# Altium project Ozgun_UKB_2025-2026.PrjPcb (part 2 of 4)
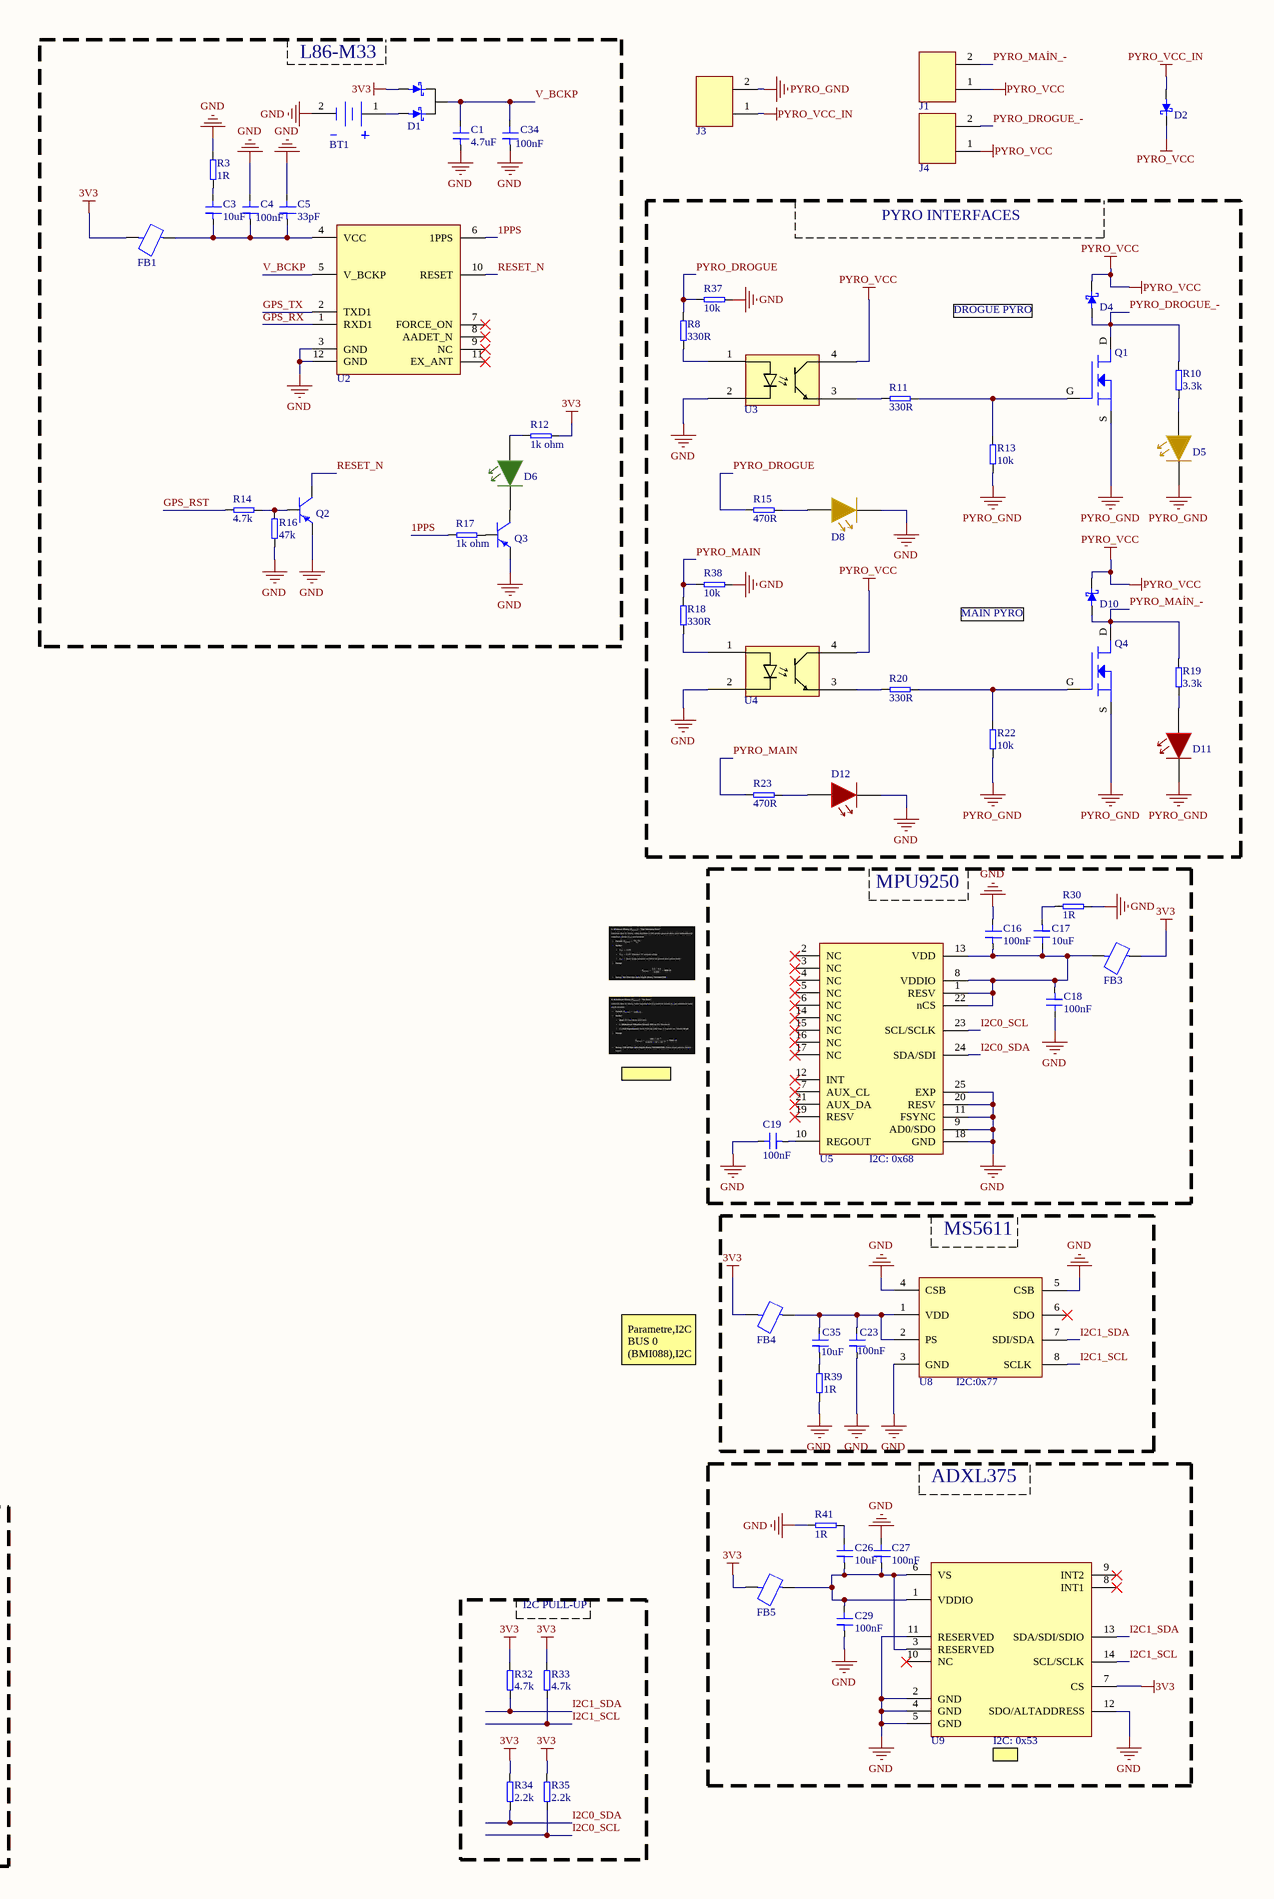
[diagram p2: Ucus_Kontrol_Bilgisayari.SchDoc, right]

## Sheet Ucus_Kontrol_Bilgisayari.SchDoc: AZAK ROKET TAKIMI ÖZGÜN UÇUŞ KONTROL BİLGİSAYARI (continued)
### Library data of the parts
BT1 = CR2032-1F2DV: Power-Xtra CR2032-1F2DV - 3V Li-MnO2 - Lithium Buton Pil - 2 Pinli - Dikey; ComponentLink1Description: Tedarikçi; ComponentLink1URL: https://www.pilpaketi.com/power-xtra-cr2032-1f2dv-3v-li-mno2-lithium-buton-pil-2-pinli-dikey; ComponentLink2Description: Tedarikçi; ComponentLink2URL: https://www.pilburada.com/power-xtra-cr2032-68-1f2-pin-dik-3v-lithium-pil-dikey; ComponentLink3Description: Tedarikçi**; ComponentLink3URL: https://www.robolinkmarket.com/power-xtra-cr2032-68-3v-lityum-dugme-pil-2-pin-dikey
C1 = Cap Cer 4.7uF %10 SMD 0603: Ceramic Capacitor, Multilayer, Ceramic, 16V, 10% +Tol, 10% -Tol, X5R, +-15% TC, 4.7uF, Surface Mount, 0603 inch; Manufacturer: Samsung Electro-Mechanics; Manufacturer Part Number: CL10A475KO8NNNC; Value: 4.7µF; Supplier: Mouser; Supplier Part Number: 187-CL10A475KO8NNNC; RoHS: Compliant; Category: Ceramic Capacitors; Stock: 255576; Pricing: 1=0,1, 10=0,014, 50=0,014, 100=0,014, 1000=0,014, 10000=0,014 (USD); Case/Package: 0603; Case Code (Imperial): 0603; Case Code (Metric): 1608; China RoHS: Compliant; Contact Plating: Tin; Depth: 800µm; Dielectric: X5R; Dielectric Material: Ceramic; Height: 900µm; Length: 1.6mm; Lifecycle Status: NRND; Material: Ceramic; Max Operating Temperature: 85°C; Min Operating Temperature: -55°C; Mounting Technology: Surface Mount; Number of Terminals: 2; Radiation Hardening: No; REACH SVHC: Yes; Schedule B: 8532240020, 8532240020|8532240020|8532240020|8532240020|8532240020|8532240020|8532240020|8532240020|8532240020|8532240020|8532240020|8532240020|8532240020|8532240020|8532240020|8532240020|8532240020|8532240020|8532240020|8532240020|8532240020|8532240020|8532240020|85; Thickness: 889µm; Tolerance: 10%; Voltage: 16V; Voltage Rating: 16V; Voltage Rating (DC): 16V; Width: 800µm; ComponentLink1URL: https://datasheet.octopart.com:443/CL10A475KO8NNNC-Samsung-Electro-Mechanics-datasheet-136031787.pdf?src-supplier=IHS; ComponentLink1Description: https://datasheet.octopart.com:443/CL10A475KO8NNNC-Samsung-Electro-Mechanics-datasheet-136031787.pdf?src-supplier=IHS; ComponentLink2URL: https://datasheet.octopart.com:443/CL10A475KO8NNNC-Samsung-Electro-Mechanics-datasheet-81461811.pdf?src-supplier=Upverter; ComponentLink2Description: https://datasheet.octopart.com:443/CL10A475KO8NNNC-Samsung-Electro-Mechanics-datasheet-81461811.pdf?src-supplier=Upverter; ComponentLink3URL: https://datasheet.octopart.com/CL10A475KO8NNNC-Samsung-Electro-Mechanics-datasheet-8324245.pdf; ComponentLink3Description: https://datasheet.octopart.com/CL10A475KO8NNNC-Samsung-Electro-Mechanics-datasheet-8324245.pdf; ComponentLink4URL: https://datasheet.octopart.com/CL10A475KO8NNNC-Samsung-Electro-Mechanics-datasheet-97040617.pdf; ComponentLink4Description: https://datasheet.octopart.com/CL10A475KO8NNNC-Samsung-Electro-Mechanics-datasheet-97040617.pdf; ComponentLink5URL: https://datasheet.octopart.com/General-Multilayer-Ceramic-Capacitors-Samsung-datasheet-family-111.pdf; ComponentLink5Description: https://datasheet.octopart.com/General-Multilayer-Ceramic-Capacitors-Samsung-datasheet-family-111.pdf; ComponentLink6URL: https://datasheet.octopart.com:443/CL10A475KO8NNNC-Samsung-Electro-Mechanics-datasheet-110226305.pdf?src-supplier=Future+Electronics; ComponentLink6Description: https://datasheet.octopart.com:443/CL10A475KO8NNNC-Samsung-Electro-Mechanics-datasheet-110226305.pdf?src-supplier=Future+Electronics; ComponentLink7URL: https://datasheet.octopart.com:443/CL10A475KO8NNNC-Samsung-datasheet-44382858.pdf?src-supplier=Future+Electronics; ComponentLink7Description: https://datasheet.octopart.com:443/CL10A475KO8NNNC-Samsung-datasheet-44382858.pdf?src-supplier=Future+Electronics; ComponentLink8URL: https://datasheet.octopart.com:443/CL10A475KO8NNNC-Samsung-datasheet-12513645.pdf?src-supplier=Future+Electronics; ComponentLink8Description: https://datasheet.octopart.com:443/CL10A475KO8NNNC-Samsung-datasheet-12513645.pdf?src-supplier=Future+Electronics; ComponentLink9URL: https://datasheet.octopart.com:443/CL10A475KO8NNNC-Samsung-datasheet-26589133.pdf?src-supplier=Future+Electronics; ComponentLink9Description: https://datasheet.octopart.com:443/CL10A475KO8NNNC-Samsung-datasheet-26589133.pdf?src-supplier=Future+Electronics; ComponentLink10URL: https://datasheet.octopart.com:443/CL10A475KO8NNNC-Samsung-datasheet-11541288.pdf?src-supplier=Future+Electronics; ComponentLink10Description: https://datasheet.octopart.com:443/CL10A475KO8NNNC-Samsung-datasheet-11541288.pdf?src-supplier=Future+Electronics; ComponentLink11URL: https://datasheet.octopart.com:443/CL10A475KO8NNNC-Samsung-Electro-Mechanics-datasheet-149158806.pdf?src-supplier=Future+Electronics; ComponentLink11Description: https://datasheet.octopart.com:443/CL10A475KO8NNNC-Samsung-Electro-Mechanics-datasheet-149158806.pdf?src-supplier=Future+Electronics; ComponentLink12URL: https://datasheet.octopart.com:443/CL10A475KO8NNNC-Samsung-Electro-Mechanics-datasheet-11892693.pdf?src-supplier=Arrow+Electronics; ComponentLink12Description: https://datasheet.octopart.com:443/CL10A475KO8NNNC-Samsung-Electro-Mechanics-datasheet-11892693.pdf?src-supplier=Arrow+Electronics; ComponentLink13URL: https://datasheet.octopart.com:443/CL10A475KO8NNNC-Samsung-datasheet-59220082.pdf?src-supplier=TME; ComponentLink13Description: https://datasheet.octopart.com:443/CL10A475KO8NNNC-Samsung-datasheet-59220082.pdf?src-supplier=TME; ComponentLink14URL: http://sigma.octopart.com:80/rohs_certificate/General-Multilayer-Ceramic-Capacitors-Samsung-family-110.pdf?src-supplier=Compliance+Statements; ComponentLink14Description: http://sigma.octopart.com:80/rohs_certificate/General-Multilayer-Ceramic-Capacitors-Samsung-family-110.pdf?src-supplier=Compliance+Statements; ComponentLink15URL: http://sigma.octopart.com:80/rohs_statement/General-Multilayer-Ceramic-Capacitors-Samsung-family-132.pdf?src-supplier=Compliance+Statements; ComponentLink15Description: http://sigma.octopart.com:80/rohs_statement/General-Multilayer-Ceramic-Capacitors-Samsung-family-132.pdf?src-supplier=Compliance+Statements; ComponentLink16URL: http://sigma.octopart.com:80/reach_statement/General-Multilayer-Ceramic-Capacitors-Samsung-family-133.pdf?src-supplier=Compliance+Statements; ComponentLink16Description: http://sigma.octopart.com:80/reach_statement/General-Multilayer-Ceramic-Capacitors-Samsung-family-133.pdf?src-supplier=Compliance+Statements; ComponentLink17Description: Tedarikçi; ComponentLink17URL: https://www.ozdisan.com/p/smt-smd-ve-mlcc-kapasitorler-184/samsung-cl10a475ko8nnnc-522172
C2 C4 C14 C16 C18-C20 C22 C23 C25 C27-C34 = Cap Cer 0.1uF %10 SMD 0603: Ceramic Capacitor, Multilayer, Ceramic, 50V, 5% +Tol, 5% -Tol, X7R, 15% TC, 0.1uF, Surface Mount, 0603; Manufacturer: KEMET; Manufacturer Part Number: C0603C104J5RAC7867; Designed by: Eren/Mehmet; Multilayer: Yes; Supplier: Mouser; Supplier Part Number: 80-C0603C104J5R; RoHS: Yes; Category: Ceramic Capacitors; Stock: 477636; Pricing: 1=0,12, 10=0,049, 50=0,049, 100=0,029, 1000=0,027, 10000=0,01 (USD); Mounting Technology: Surface Mount; Pins: 2; Dielectric Material: Ceramic; Package Shape: Rectangular; Case/Package: 0603; Terminal Finish: Nickel; Min Operating Temperature: -55°C; Max Operating Temperature: 125°C; JESD-609 Code: e3; Value: 100nF; Capacitor Type: Ceramic; Tolerance  (fill in as +-): 5%; Package Style: SMTMeter; Packaging: Tape and Reel; Tolerance (fill in as +-): 5%; Rated DC Voltage (URdc): 50V; Temperature Characteristics Code: X7R; Termination: Wraparound; Length: 1.6mm; Width: 0.8mm; Height: 0.8mm; Reach SVHC Compliant: Yes; RoHS Compliant: Yes; ComponentLink1URL: https://datasheet.ciiva.com:443/pdfs/VipMasterIC/IC/KEME/KEME-S-A0008991654/KEME-S-A0008991654-1.pdf?src-supplier=IHS+Markit; ComponentLink1Description: Datasheet; ComponentLink2URL: https://datasheet.ciiva.com/28645/1851736-28645621.pdf?src-supplier=Element14; ComponentLink2Description: https://datasheet.ciiva.com/28645/1851736-28645621.pdf?src-supplier=Element14; ComponentLink3URL: https://datasheet.ciiva.com/46385/1851736-46385374.pdf?src-supplier=Element14; ComponentLink3Description: https://datasheet.ciiva.com/46385/1851736-46385374.pdf?src-supplier=Element14; ComponentLink4URL: https://datasheet.ciiva.com/46424/1851736-46424174.pdf?src-supplier=Element14; ComponentLink4Description: https://datasheet.ciiva.com/46424/1851736-46424174.pdf?src-supplier=Element14; ComponentLink5URL: https://datasheet.ciiva.com/18192/getdatasheetpartid-347940-18192678.pdf?src-supplier=Verical; ComponentLink5Description: https://datasheet.ciiva.com/18192/getdatasheetpartid-347940-18192678.pdf?src-supplier=Verical; ComponentLink6URL: https://datasheet.ciiva.com/18100/getdatasheetpartid-37078-18100981.pdf?src-supplier=Verical; ComponentLink6Description: https://datasheet.ciiva.com/18100/getdatasheetpartid-37078-18100981.pdf?src-supplier=Verical; ComponentLink7Description: Supplier; ComponentLink7URL: https://www.ozdisan.com/pasif-komponentler/kapasitorler/smt-smd-ve-mlcc-kapasitorler/C0603C104J5RAC7867/610231
C3 C17 C26 C35 = Cap Cer 10uF %10 SMD 0805: Ceramic Capacitor, Multilayer, Ceramic, 16V, 10% +Tol, 10% -Tol, X7R, 15% TC, 10uF, Surface Mount, 0805; Manufacturer: Samsung; Manufacturer Part Number: CL21B106KOQNNNE; Designed by: Eren/Mehmet; Multilayer: Yes; Supplier: Mouser; Supplier Part Number: 187-CL21B106KOQNNNE; RoHS: Yes; Category: Ceramic Capacitors; Stock: 313805; Pricing: 1=0,18, 10=0,073, 50=0,073, 100=0,06, 1000=0,048, 10000=0,03 (USD); Mounting Technology: Surface Mount; Pins: 2; Dielectric Material: Ceramic; Package Shape: Rectangular; Case/Package: 0805; Terminal Finish: Nickel; Min Operating Temperature: -55°C; Max Operating Temperature: 125°C; JESD-609 Code: e3; Value: 10uF; Capacitor Type: Ceramic; Tolerance  (fill in as +-): 10%; Package Style: SMTMeter; Packaging: Tape and Reel; Tolerance (fill in as +-): 10%; Rated DC Voltage (URdc): 16V; Temperature Characteristics Code: X7R; Termination: Wraparound; Length: 2mm; Width: 1.25mm; Height: 1.4mm; Reach SVHC Compliant: Yes; RoHS Compliant: Yes; ComponentLink1URL: https://datasheet.ciiva.com:443/pdfs/VipMasterIC/IC/SEMS/SEMS-S-A0008523115/SEMS-S-A0008523296-1.pdf?src-supplier=IHS+Markit; ComponentLink1Description: Datasheet; ComponentLink2URL: https://datasheet.ciiva.com/25794/cl21b106koqnnne-25794472.pdf?src-supplier=Digikey; ComponentLink2Description: https://datasheet.ciiva.com/25794/cl21b106koqnnne-25794472.pdf?src-supplier=Digikey; ComponentLink3URL: https://datasheet.ciiva.com/16428/cl21b106koqnnne-16428887.pdf?src-supplier=Future+Electronics; ComponentLink3Description: https://datasheet.ciiva.com/16428/cl21b106koqnnne-16428887.pdf?src-supplier=Future+Electronics; ComponentLink4URL: https://datasheet.ciiva.com/26920/getdatasheetpartid-355170-26920201.pdf?src-supplier=Verical; ComponentLink4Description: https://datasheet.ciiva.com/26920/getdatasheetpartid-355170-26920201.pdf?src-supplier=Verical; ComponentLink5Description: Supplier; ComponentLink5URL: https://www.ozdisan.com/Product/Detail/355008/CL21B106KOQNNNE
C5 = Cap Cer 33pF %5 SMD 0603: 50V 33pF NP0 ±5% 0603 Multilayer Ceramic Capacitors MLCC - SMD/SMT ROHS; Manufacturer: Yageo Group; Manufacturer Part Number: CC0603JRNPO9BN330; Dielectric: C0G; Insulation Resistance: 100GΩ; Temperature Coefficient: 30ppm/°C; Supplier: Mouser; Supplier Part Number: 603-C0603JRNPO9BN330; RoHS: Compliant; Category: Ceramic Capacitors; Stock: 3723; Pricing: 1=0,1, 10=0,022, 50=0,022, 100=0,019, 1000=0,012, 10000=0,007 (USD); Value: 33pF; Case/Package: 0603; Case Code (Imperial): 0603; China RoHS: Compliant; Composition: Ceramic; Depth: 800µm; Dielectric Material: Ceramic; Halogen Free: Halogen Free; Height: 800µm; Lead Free: Lead Free; Length: 1.6mm; Lifecycle Status: Production; Material: Ceramic; Max Operating Temperature: 125°C; Min Operating Temperature: -55°C; Mounting Technology: Surface Mount; Pins: 2; Number of Terminals: 2; Radiation Hardening: No; REACH SVHC: Yes; Schedule B: 8532240020, 8532240020|8532240020|8532240020|8532240020|8532240020|8532240020|8532240020|8532240020|8532240020|8532240020|8532240020|8532240020|8532240020|8532240020, 8532240020|8532240020|8532240020|8532240020|8532240020|8532240020|8532240020|8532240020|8532240020|8532240020|8532240020|8532240020|8532240020|8532240020|8532240020, 8532240020|8532240020|8532240020|8532240020|8532240020|8532240020|8532240020|8532240020|8532240020|8532240020|8532240020|8532240020|8532240020|8532240020|8532240020|8532240020; Termination: SMD/SMT; Thickness: 889µm; Tolerance: 5%; Voltage: 50V; Voltage Rating: 50V; Voltage Rating (AC): 50V; Voltage Rating (DC): 50V; Width: 800µm; ComponentLink1URL: https://datasheet.octopart.com:443/CC0603JRNPO9BN330-Yageo-datasheet-182140217.pdf?src-supplier=IHS; ComponentLink1Description: https://datasheet.octopart.com:443/CC0603JRNPO9BN330-Yageo-datasheet-182140217.pdf?src-supplier=IHS; ComponentLink2URL: https://sigma.octopart.com:443/147830939/technical_drawing/Yageo-CC0603JRNPO9BN330.pdf?src-supplier=Upverter; ComponentLink2Description: https://sigma.octopart.com:443/147830939/technical_drawing/Yageo-CC0603JRNPO9BN330.pdf?src-supplier=Upverter; ComponentLink3URL: https://datasheet.octopart.com:443/CC0603JRNPO9BN330-Yageo-datasheet-10406438.pdf?src-supplier=element14+APAC; ComponentLink3Description: https://datasheet.octopart.com:443/CC0603JRNPO9BN330-Yageo-datasheet-10406438.pdf?src-supplier=element14+APAC; ComponentLink4URL: https://datasheet.octopart.com:443/CC0603JRNPO9BN330-Yageo-datasheet-65873193.pdf?src-supplier=element14+APAC; ComponentLink4Description: https://datasheet.octopart.com:443/CC0603JRNPO9BN330-Yageo-datasheet-65873193.pdf?src-supplier=element14+APAC; ComponentLink5URL: https://datasheet.octopart.com:443/CC0603JRNPO9BN330-Yageo-datasheet-67645495.pdf?src-supplier=element14+APAC; ComponentLink5Description: https://datasheet.octopart.com:443/CC0603JRNPO9BN330-Yageo-datasheet-67645495.pdf?src-supplier=element14+APAC; ComponentLink6URL: https://datasheet.octopart.com:443/CC0603JRNPO9BN330-Yageo-datasheet-10882999.pdf?src-supplier=element14+APAC; ComponentLink6Description: https://datasheet.octopart.com:443/CC0603JRNPO9BN330-Yageo-datasheet-10882999.pdf?src-supplier=element14+APAC; ComponentLink7URL: https://datasheet.octopart.com:443/CC0603JRNPO9BN330-Yageo-datasheet-151948684.pdf?src-supplier=Newark; ComponentLink7Description: https://datasheet.octopart.com:443/CC0603JRNPO9BN330-Yageo-datasheet-151948684.pdf?src-supplier=Newark; ComponentLink8URL: https://datasheet.octopart.com:443/CC0603JRNPO9BN330-Yageo-datasheet-181968235.pdf?src-supplier=Newark; ComponentLink8Description: https://datasheet.octopart.com:443/CC0603JRNPO9BN330-Yageo-datasheet-181968235.pdf?src-supplier=Newark; ComponentLink9URL: https://datasheet.octopart.com:443/CC0603JRNPO9BN330-Yageo-datasheet-181968231.pdf?src-supplier=Newark; ComponentLink9Description: https://datasheet.octopart.com:443/CC0603JRNPO9BN330-Yageo-datasheet-181968231.pdf?src-supplier=Newark; ComponentLink10URL: https://datasheet.octopart.com:443/CC0603JRNPO9BN330-Yageo-datasheet-504625.pdf?src-supplier=Newark; ComponentLink10Description: https://datasheet.octopart.com:443/CC0603JRNPO9BN330-Yageo-datasheet-504625.pdf?src-supplier=Newark; ComponentLink11URL: https://datasheet.octopart.com:443/CC0603JRNPO9BN330-Yageo-datasheet-5321569.pdf?src-supplier=Newark; ComponentLink11Description: https://datasheet.octopart.com:443/CC0603JRNPO9BN330-Yageo-datasheet-5321569.pdf?src-supplier=Newark; ComponentLink12URL: https://datasheet.octopart.com:443/CC0603JRNPO9BN330-Yageo-datasheet-137875056.pdf?src-supplier=Future+Electronics; ComponentLink12Description: https://datasheet.octopart.com:443/CC0603JRNPO9BN330-Yageo-datasheet-137875056.pdf?src-supplier=Future+Electronics; ComponentLink13URL: https://datasheet.octopart.com:443/CC0603JRNPO9BN330-Yageo-datasheet-136957424.pdf?src-supplier=Future+Electronics; ComponentLink13Description: https://datasheet.octopart.com:443/CC0603JRNPO9BN330-Yageo-datasheet-136957424.pdf?src-supplier=Future+Electronics; ComponentLink14URL: https://datasheet.octopart.com:443/CC0603JRNPO9BN330-Yageo-datasheet-137700082.pdf?src-supplier=Future+Electronics; ComponentLink14Description: https://datasheet.octopart.com:443/CC0603JRNPO9BN330-Yageo-datasheet-137700082.pdf?src-supplier=Future+Electronics; ComponentLink15URL: https://datasheet.octopart.com:443/CC0603JRNPO9BN330-Yageo-datasheet-78855684.pdf?src-supplier=Future+Electronics; ComponentLink15Description: https://datasheet.octopart.com:443/CC0603JRNPO9BN330-Yageo-datasheet-78855684.pdf?src-supplier=Future+Electronics; ComponentLink16URL: https://datasheet.octopart.com:443/CC0603JRNPO9BN330-Yageo-datasheet-62091628.pdf?src-supplier=Future+Electronics; ComponentLink16Description: https://datasheet.octopart.com:443/CC0603JRNPO9BN330-Yageo-datasheet-62091628.pdf?src-supplier=Future+Electronics; ComponentLink17URL: https://datasheet.octopart.com:443/CC0603JRNPO9BN330-Yageo-datasheet-24578986.pdf?src-supplier=Future+Electronics; ComponentLink17Description: https://datasheet.octopart.com:443/CC0603JRNPO9BN330-Yageo-datasheet-24578986.pdf?src-supplier=Future+Electronics; ComponentLink18URL: https://datasheet.octopart.com:443/CC0603JRNPO9BN330-Yageo-datasheet-16730043.pdf?src-supplier=Future+Electronics; ComponentLink18Description: https://datasheet.octopart.com:443/CC0603JRNPO9BN330-Yageo-datasheet-16730043.pdf?src-supplier=Future+Electronics; ComponentLink19URL: https://datasheet.octopart.com:443/CC0603JRNPO9BN330-Yageo-datasheet-15895757.pdf?src-supplier=Future+Electronics; ComponentLink19Description: https://datasheet.octopart.com:443/CC0603JRNPO9BN330-Yageo-datasheet-15895757.pdf?src-supplier=Future+Electronics; ComponentLink20URL: https://datasheet.octopart.com:443/CC0603JRNPO9BN330-Yageo-datasheet-12589826.pdf?src-supplier=Future+Electronics; ComponentLink20Description: https://datasheet.octopart.com:443/CC0603JRNPO9BN330-Yageo-datasheet-12589826.pdf?src-supplier=Future+Electronics; ComponentLink21URL: https://datasheet.octopart.com:443/CC0603JRNPO9BN330-Yageo-datasheet-8817079.pdf?src-supplier=element14; ComponentLink21Description: https://datasheet.octopart.com:443/CC0603JRNPO9BN330-Yageo-datasheet-8817079.pdf?src-supplier=element14; ComponentLink22URL: https://datasheet.octopart.com:443/CC0603JRNPO9BN330-Yageo-datasheet-8324240.pdf?src-supplier=element14; ComponentLink22Description: https://datasheet.octopart.com:443/CC0603JRNPO9BN330-Yageo-datasheet-8324240.pdf?src-supplier=element14; ComponentLink23URL: https://datasheet.octopart.com:443/CC0603JRNPO9BN330-Yageo-datasheet-8643175.pdf?src-supplier=SOS+electronic; ComponentLink23Description: https://datasheet.octopart.com:443/CC0603JRNPO9BN330-Yageo-datasheet-8643175.pdf?src-supplier=SOS+electronic; ComponentLink24URL: https://datasheet.octopart.com:443/CC0603JRNPO9BN330-Yageo-datasheet-8555986.pdf?src-supplier=TME; ComponentLink24Description: https://datasheet.octopart.com:443/CC0603JRNPO9BN330-Yageo-datasheet-8555986.pdf?src-supplier=TME; ComponentLink25URL: http://sigma.octopart.com:80/conflict_mineral_statement/Yageo-company-3.pdf?src-supplier=Compliance+Statements; ComponentLink25Description: http://sigma.octopart.com:80/conflict_mineral_statement/Yageo-company-3.pdf?src-supplier=Compliance+Statements; ComponentLink26URL: http://sigma.octopart.com:80/rohs_statement/Yageo-company-2.pdf?src-supplier=Compliance+Statements; ComponentLink26Description: http://sigma.octopart.com:80/rohs_statement/Yageo-company-2.pdf?src-supplier=Compliance+Statements; ComponentLink27Description: Tedarikçi; ComponentLink27URL: https://www.ozdisan.com/p/smt-smd-ve-mlcc-kapasitorler-184/yageo-cc0603jrnpo9bn330-747241
C6 C7 = Cap Cer 10uF %10 SMD 1206 (25V): Ceramic Capacitor, Multilayer, Ceramic, 25V, 10% +Tol, 10% -Tol, X7R, +-15% TC, 10uF, Surface Mount, 1206 inch; Manufacturer: Samsung Electro-Mechanics; Manufacturer Part Number: CL31B106KAHNNNE; Value: 10µF; Supplier: Mouser; Supplier Part Number: 187-CL31B106KAHNNNE; RoHS: Compliant; Category: Ceramic Capacitors; Stock: 482438; Pricing: 1=0,1, 10=0,036, 50=0,036, 100=0,036, 1000=0,036, 10000=0,035 (USD); Case/Package: 1206; Case Code (Imperial): 1206; Case Code (Metric): 3216; China RoHS: Compliant; Depth: 1.6mm; Dielectric: X7R; Dielectric Material: Ceramic; Height: 1.8mm; Length: 3.2mm; Lifecycle Status: Production; Material: Ceramic; Max Operating Temperature: 125°C; Min Operating Temperature: -55°C; Mounting Technology: Surface Mount; Number of Terminals: 2; Radiation Hardening: No; REACH SVHC: Yes; Schedule B: 8532240020, 8532240020|8532240020|8532240020|8532240020|8532240020; Thickness: 1.8034mm; Tolerance: 10%; Voltage: 25V; Voltage Rating: 25V; Voltage Rating (DC): 25V; Width: 1.6mm; ComponentLink1URL: https://datasheet.octopart.com:443/CL31B106KAHNNNE-Samsung-Electro-Mechanics-datasheet-182024324.pdf?src-supplier=IHS; ComponentLink1Description: https://datasheet.octopart.com:443/CL31B106KAHNNNE-Samsung-Electro-Mechanics-datasheet-182024324.pdf?src-supplier=IHS; ComponentLink2URL: https://datasheet.octopart.com:443/CL31B106KAHNNNE-Samsung-Electro-Mechanics-datasheet-136482614.pdf?src-supplier=Samsung+SCT; ComponentLink2Description: https://datasheet.octopart.com:443/CL31B106KAHNNNE-Samsung-Electro-Mechanics-datasheet-136482614.pdf?src-supplier=Samsung+SCT; ComponentLink3URL: https://datasheet.octopart.com:443/CL31B106KAHNNNE-Samsung-Electro-Mechanics-datasheet-11609088.pdf?src-supplier=Future+Electronics; ComponentLink3Description: https://datasheet.octopart.com:443/CL31B106KAHNNNE-Samsung-Electro-Mechanics-datasheet-11609088.pdf?src-supplier=Future+Electronics; ComponentLink4URL: https://datasheet.octopart.com:443/CL31B106KAHNNNE-Samsung-Electro-Mechanics-datasheet-149066873.pdf?src-supplier=Future+Electronics; ComponentLink4Description: https://datasheet.octopart.com:443/CL31B106KAHNNNE-Samsung-Electro-Mechanics-datasheet-149066873.pdf?src-supplier=Future+Electronics; ComponentLink5URL: https://datasheet.octopart.com:443/CL31B106KAHNNNE-Samsung-Electro-Mechanics-datasheet-116051334.pdf?src-supplier=Future+Electronics; ComponentLink5Description: https://datasheet.octopart.com:443/CL31B106KAHNNNE-Samsung-Electro-Mechanics-datasheet-116051334.pdf?src-supplier=Future+Electronics; ComponentLink6URL: https://datasheet.octopart.com:443/CL31B106KAHNNNE-Samsung-Electro-Mechanics-datasheet-81462475.pdf?src-supplier=Future+Electronics; ComponentLink6Description: https://datasheet.octopart.com:443/CL31B106KAHNNNE-Samsung-Electro-Mechanics-datasheet-81462475.pdf?src-supplier=Future+Electronics; ComponentLink7URL: https://datasheet.octopart.com:443/CL31B106KAHNNNE-Samsung-datasheet-42485257.pdf?src-supplier=Future+Electronics; ComponentLink7Description: https://datasheet.octopart.com:443/CL31B106KAHNNNE-Samsung-datasheet-42485257.pdf?src-supplier=Future+Electronics; ComponentLink8URL: https://datasheet.octopart.com/CL31B106KAHNNNE-Samsung-Electro-Mechanics-datasheet-8324245.pdf; ComponentLink8Description: https://datasheet.octopart.com/CL31B106KAHNNNE-Samsung-Electro-Mechanics-datasheet-8324245.pdf; ComponentLink9URL: https://datasheet.octopart.com/CL31B106KAHNNNE-Samsung-Electro-Mechanics-datasheet-97040617.pdf; ComponentLink9Description: https://datasheet.octopart.com/CL31B106KAHNNNE-Samsung-Electro-Mechanics-datasheet-97040617.pdf; ComponentLink10URL: https://datasheet.octopart.com/General-Multilayer-Ceramic-Capacitors-Samsung-datasheet-family-111.pdf; ComponentLink10Description: https://datasheet.octopart.com/General-Multilayer-Ceramic-Capacitors-Samsung-datasheet-family-111.pdf; ComponentLink11URL: https://datasheet.octopart.com:443/CL31B106KAHNNNE-Samsung-datasheet-59220082.pdf?src-supplier=TME; ComponentLink11Description: https://datasheet.octopart.com:443/CL31B106KAHNNNE-Samsung-datasheet-59220082.pdf?src-supplier=TME; ComponentLink12URL: http://sigma.octopart.com:80/rohs_certificate/General-Multilayer-Ceramic-Capacitors-Samsung-family-110.pdf?src-supplier=Compliance+Statements; ComponentLink12Description: http://sigma.octopart.com:80/rohs_certificate/General-Multilayer-Ceramic-Capacitors-Samsung-family-110.pdf?src-supplier=Compliance+Statements; ComponentLink13URL: http://sigma.octopart.com:80/rohs_statement/General-Multilayer-Ceramic-Capacitors-Samsung-family-132.pdf?src-supplier=Compliance+Statements; ComponentLink13Description: http://sigma.octopart.com:80/rohs_statement/General-Multilayer-Ceramic-Capacitors-Samsung-family-132.pdf?src-supplier=Compliance+Statements; ComponentLink14URL: http://sigma.octopart.com:80/reach_statement/General-Multilayer-Ceramic-Capacitors-Samsung-family-133.pdf?src-supplier=Compliance+Statements; ComponentLink14Description: http://sigma.octopart.com:80/reach_statement/General-Multilayer-Ceramic-Capacitors-Samsung-family-133.pdf?src-supplier=Compliance+Statements; ComponentLink15Description: Tedarikçi; ComponentLink15URL: https://www.ozdisan.com/p/smt-smd-ve-mlcc-kapasitorler-184/samsung-cl31b106kahnnne-35896
C8-C10 C13 C24 C36 = Cap Cer 22uF %10 SMD 1206: Ceramic Capacitor, Multilayer, Ceramic, 10V, 10% +Tol, 10% -Tol, X7R, 15% TC, 22uF, Surface Mount, 1206; Manufacturer: Samsung; Manufacturer Part Number: CL31B226KPHNNNE; Designed by: Eren/Mehmet; Multilayer: Yes; Supplier: Mouser; Supplier Part Number: 187-CL31B226KPHNNNE; RoHS: Yes; Category: Ceramic Capacitors; Stock: 142217; Pricing: 1=0,38, 10=0,184, 50=0,184, 100=0,126, 1000=0,113, 10000=0,083 (USD); Mounting Technology: Surface Mount; Pins: 2; Dielectric Material: Ceramic; Package Shape: Rectangular; Case/Package: 1206; Terminal Finish: Nickel; Min Operating Temperature: -55°C; Max Operating Temperature: 125°C; Termination: Wraparound; JESD-609 Code: e3; Value: 22uF; Capacitor Type: Ceramic; Tolerance  (fill in as +-): 10%; Package Style: SMTMeter; Packaging: Tape and Reel; Tolerance (fill in as +-): 10%; Rated DC Voltage (URdc): 10V; Temperature Characteristics Code: X7R; Length: 3.2mm; Width: 1.6mm; Height: 1.8mm; Reach SVHC Compliant: Yes; RoHS Compliant: Yes; ComponentLink1URL: https://datasheet.ciiva.com:443/pdfs/VipMasterIC/IC/SEMS/SEMS-S-A0008384515/SEMS-S-A0008886067-1.pdf?src-supplier=IHS+Markit; ComponentLink1Description: Datasheet; ComponentLink2URL: https://datasheet.ciiva.com/25724/cl31b226kphnnne-25724443.pdf?src-supplier=Digikey; ComponentLink2Description: https://datasheet.ciiva.com/25724/cl31b226kphnnne-25724443.pdf?src-supplier=Digikey; ComponentLink3URL: https://datasheet.ciiva.com/16384/cl31b226kphnnne-16384588.pdf?src-supplier=Future+Electronics; ComponentLink3Description: https://datasheet.ciiva.com/16384/cl31b226kphnnne-16384588.pdf?src-supplier=Future+Electronics; ComponentLink4URL: https://datasheet.ciiva.com/26838/getdatasheetpartid-710483-26838941.pdf?src-supplier=Verical; ComponentLink4Description: https://datasheet.ciiva.com/26838/getdatasheetpartid-710483-26838941.pdf?src-supplier=Verical; ComponentLink5Description: Supplier; ComponentLink5URL: https://www.ozdisan.com/pasif-komponentler/kapasitorler/smt-smd-ve-mlcc-kapasitorler/CL31B226KPHNNNE/523424
C11 = Cap Cer 56pF %5 SMD 0603: Multilayer Ceramic Capacitor, 56 pF, 50 V, ± 5%, C0G (NP0), 0603 [1608 Metric]; Manufacturer: Samsung Electro-Mechanics; Manufacturer Part Number: CL10C560JB8NNNC; Temperature Coefficient: 30ppm/°C; Voltage: 50V; Supplier: Mouser; Supplier Part Number: 187-CL10C560JB8NNNC; RoHS: Compliant; Category: Ceramic Capacitors; Stock: 33472; Pricing: 1=0,1, 10=0,023, 50=0,023, 100=0,02, 1000=0,013, 10000=0,007 (USD); Value: 56pF; Case/Package: 0603; Case Code (Imperial): 0603; Case Code (Metric): 1608; China RoHS: Compliant; Depth: 800µm; Dielectric: C0G; Dielectric Material: Ceramic; Height: 900µm; Lead Free: Lead Free; Length: 1.6mm; Lifecycle Status: Production; Material: Ceramic; Max Operating Temperature: 125°C; Min Operating Temperature: -55°C; Mounting Technology: Surface Mount; Number of Terminals: 2; Radiation Hardening: No; REACH SVHC: Yes; Schedule B: 8532240020, 8532240020|8532240020, 8532240020|8532240020|8532240020, 8532240020|8532240020|8532240020|8532240020; Termination: SMD/SMT; Thickness: 889µm; Tolerance: 5%; Voltage Rating: 50V; Voltage Rating (DC): 50V; Width: 800µm; ComponentLink1URL: https://datasheet.octopart.com:443/CL10C560JB8NNNC-Samsung-Electro-Mechanics-datasheet-136482443.pdf?src-supplier=IHS; ComponentLink1Description: https://datasheet.octopart.com:443/CL10C560JB8NNNC-Samsung-Electro-Mechanics-datasheet-136482443.pdf?src-supplier=IHS; ComponentLink2URL: https://datasheet.octopart.com/CL10C560JB8NNNC-Samsung-Electro-Mechanics-datasheet-8324245.pdf; ComponentLink2Description: https://datasheet.octopart.com/CL10C560JB8NNNC-Samsung-Electro-Mechanics-datasheet-8324245.pdf; ComponentLink3URL: https://datasheet.octopart.com/CL10C560JB8NNNC-Samsung-Electro-Mechanics-datasheet-97040617.pdf; ComponentLink3Description: https://datasheet.octopart.com/CL10C560JB8NNNC-Samsung-Electro-Mechanics-datasheet-97040617.pdf; ComponentLink4URL: https://datasheet.octopart.com:443/CL10C560JB8NNNC-Samsung-Electro-Mechanics-datasheet-110326873.pdf?src-supplier=Future+Electronics; ComponentLink4Description: https://datasheet.octopart.com:443/CL10C560JB8NNNC-Samsung-Electro-Mechanics-datasheet-110326873.pdf?src-supplier=Future+Electronics; ComponentLink5URL: https://datasheet.octopart.com:443/CL10C560JB8NNNC-Samsung-Electro-Mechanics-datasheet-81462072.pdf?src-supplier=Future+Electronics; ComponentLink5Description: https://datasheet.octopart.com:443/CL10C560JB8NNNC-Samsung-Electro-Mechanics-datasheet-81462072.pdf?src-supplier=Future+Electronics; ComponentLink6URL: https://datasheet.octopart.com:443/CL10C560JB8NNNC-Samsung-datasheet-48647419.pdf?src-supplier=Future+Electronics; ComponentLink6Description: https://datasheet.octopart.com:443/CL10C560JB8NNNC-Samsung-datasheet-48647419.pdf?src-supplier=Future+Electronics; ComponentLink7URL: https://datasheet.octopart.com:443/CL10C560JB8NNNC-Samsung-datasheet-26669191.pdf?src-supplier=Future+Electronics; ComponentLink7Description: https://datasheet.octopart.com:443/CL10C560JB8NNNC-Samsung-datasheet-26669191.pdf?src-supplier=Future+Electronics; ComponentLink8URL: https://datasheet.octopart.com:443/CL10C560JB8NNNC-Samsung-Electro-Mechanics-datasheet-149136933.pdf?src-supplier=Future+Electronics; ComponentLink8Description: https://datasheet.octopart.com:443/CL10C560JB8NNNC-Samsung-Electro-Mechanics-datasheet-149136933.pdf?src-supplier=Future+Electronics; ComponentLink9URL: https://datasheet.octopart.com:443/CL10C560JB8NNNC-Samsung-datasheet-8326407.pdf?src-supplier=TME; ComponentLink9Description: https://datasheet.octopart.com:443/CL10C560JB8NNNC-Samsung-datasheet-8326407.pdf?src-supplier=TME; ComponentLink10URL: https://datasheet.octopart.com:443/CL10C560JB8NNNC-Samsung-Electro-Mechanics-datasheet-11541288.pdf?src-supplier=Arrow+Electronics; ComponentLink10Description: https://datasheet.octopart.com:443/CL10C560JB8NNNC-Samsung-Electro-Mechanics-datasheet-11541288.pdf?src-supplier=Arrow+Electronics; ComponentLink11Description: Tedarikçi; ComponentLink11URL: https://www.ozdisan.com/p/smt-smd-ve-mlcc-kapasitorler-184/samsung-cl10c560jb8nnnc-470846
C12 = Cap Cer 3.3nF %10 SMD 0603: Ceramic Capacitor, Multilayer, Ceramic, 50V, 10% +Tol, 10% -Tol, X7R, +-15% TC, 3.3nF, Surface Mount, 0603 inch; Manufacturer: Samsung Electro-Mechanics; Manufacturer Part Number: CL10B332KB8NNNC; Supplier: Mouser; Supplier Part Number: 187-CL10B332KB8NNNC; RoHS: Compliant; Category: Ceramic Capacitors; Stock: 38300; Pricing: 1=0,1, 10=0,018, 50=0,018, 100=0,016, 1000=0,011, 10000=0,005 (USD); Value: 3.3nF; Case/Package: 0603; Case Code (Imperial): 0603; Case Code (Metric): 1608; China RoHS: Compliant; Contact Plating: Tin; Depth: 800µm; Dielectric: X7R; Dielectric Material: Ceramic; Height: 900µm; Lead Free: Lead Free; Length: 1.6mm; Lifecycle Status: Production; Material: Ceramic; Max Operating Temperature: 125°C; Min Operating Temperature: -55°C; Mounting Technology: Surface Mount; Number of Terminals: 2; Radiation Hardening: No; REACH SVHC: Yes; Schedule B: 8532240020, 8532240020|8532240020|8532240020|8532240020|8532240020; Thickness: 889µm; Tolerance: 10%; Voltage: 50V; Voltage Rating: 50V; Voltage Rating (DC): 50V; Width: 800µm; ComponentLink1URL: https://datasheet.octopart.com:443/CL10B332KB8NNNC-Samsung-Electro-Mechanics-datasheet-136482347.pdf?src-supplier=Newark; ComponentLink1Description: https://datasheet.octopart.com:443/CL10B332KB8NNNC-Samsung-Electro-Mechanics-datasheet-136482347.pdf?src-supplier=Newark; ComponentLink2URL: https://datasheet.octopart.com:443/CL10B332KB8NNNC-Samsung-Electro-Mechanics-datasheet-136482349.pdf?src-supplier=Newark; ComponentLink2Description: https://datasheet.octopart.com:443/CL10B332KB8NNNC-Samsung-Electro-Mechanics-datasheet-136482349.pdf?src-supplier=Newark; ComponentLink3URL: https://datasheet.octopart.com/CL10B332KB8NNNC-Samsung-Electro-Mechanics-datasheet-8324245.pdf; ComponentLink3Description: https://datasheet.octopart.com/CL10B332KB8NNNC-Samsung-Electro-Mechanics-datasheet-8324245.pdf; ComponentLink4URL: https://datasheet.octopart.com/CL10B332KB8NNNC-Samsung-Electro-Mechanics-datasheet-97040617.pdf; ComponentLink4Description: https://datasheet.octopart.com/CL10B332KB8NNNC-Samsung-Electro-Mechanics-datasheet-97040617.pdf; ComponentLink5URL: https://datasheet.octopart.com/General-Multilayer-Ceramic-Capacitors-Samsung-datasheet-family-111.pdf; ComponentLink5Description: https://datasheet.octopart.com/General-Multilayer-Ceramic-Capacitors-Samsung-datasheet-family-111.pdf; ComponentLink6URL: https://datasheet.octopart.com:443/CL10B332KB8NNNC-Samsung-Electro-Mechanics-datasheet-116120886.pdf?src-supplier=Future+Electronics; ComponentLink6Description: https://datasheet.octopart.com:443/CL10B332KB8NNNC-Samsung-Electro-Mechanics-datasheet-116120886.pdf?src-supplier=Future+Electronics; ComponentLink7URL: https://datasheet.octopart.com:443/CL10B332KB8NNNC-Samsung-Electro-Mechanics-datasheet-81461891.pdf?src-supplier=Future+Electronics; ComponentLink7Description: https://datasheet.octopart.com:443/CL10B332KB8NNNC-Samsung-Electro-Mechanics-datasheet-81461891.pdf?src-supplier=Future+Electronics; ComponentLink8URL: https://datasheet.octopart.com:443/CL10B332KB8NNNC-Samsung-datasheet-26669049.pdf?src-supplier=Future+Electronics; ComponentLink8Description: https://datasheet.octopart.com:443/CL10B332KB8NNNC-Samsung-datasheet-26669049.pdf?src-supplier=Future+Electronics; ComponentLink9URL: https://datasheet.octopart.com:443/CL10B332KB8NNNC-Samsung-Electro-Mechanics-datasheet-149136840.pdf?src-supplier=Future+Electronics; ComponentLink9Description: https://datasheet.octopart.com:443/CL10B332KB8NNNC-Samsung-Electro-Mechanics-datasheet-149136840.pdf?src-supplier=Future+Electronics; ComponentLink10URL: https://datasheet.octopart.com:443/CL10B332KB8NNNC-Samsung-datasheet-37081328.pdf?src-supplier=Future+Electronics; ComponentLink10Description: https://datasheet.octopart.com:443/CL10B332KB8NNNC-Samsung-datasheet-37081328.pdf?src-supplier=Future+Electronics; ComponentLink11URL: https://datasheet.octopart.com:443/CL10B332KB8NNNC-Samsung-datasheet-8326407.pdf?src-supplier=TME; ComponentLink11Description: https://datasheet.octopart.com:443/CL10B332KB8NNNC-Samsung-datasheet-8326407.pdf?src-supplier=TME; ComponentLink12URL: https://datasheet.octopart.com:443/CL10B332KB8NNNC-Samsung-datasheet-59220082.pdf?src-supplier=TME; ComponentLink12Description: https://datasheet.octopart.com:443/CL10B332KB8NNNC-Samsung-datasheet-59220082.pdf?src-supplier=TME; ComponentLink13URL: http://sigma.octopart.com:80/rohs_certificate/General-Multilayer-Ceramic-Capacitors-Samsung-family-110.pdf?src-supplier=Compliance+Statements; ComponentLink13Description: http://sigma.octopart.com:80/rohs_certificate/General-Multilayer-Ceramic-Capacitors-Samsung-family-110.pdf?src-supplier=Compliance+Statements; ComponentLink14URL: http://sigma.octopart.com:80/rohs_statement/General-Multilayer-Ceramic-Capacitors-Samsung-family-132.pdf?src-supplier=Compliance+Statements; ComponentLink14Description: http://sigma.octopart.com:80/rohs_statement/General-Multilayer-Ceramic-Capacitors-Samsung-family-132.pdf?src-supplier=Compliance+Statements; ComponentLink15URL: http://sigma.octopart.com:80/reach_statement/General-Multilayer-Ceramic-Capacitors-Samsung-family-133.pdf?src-supplier=Compliance+Statements; ComponentLink15Description: http://sigma.octopart.com:80/reach_statement/General-Multilayer-Ceramic-Capacitors-Samsung-family-133.pdf?src-supplier=Compliance+Statements; ComponentLink16Description: Tedarikçi; ComponentLink16URL: https://www.ozdisan.com/p/smt-smd-ve-mlcc-kapasitorler-184/samsung-cl10b332kb8nnnc-26813
C15 = Cap Cer 1uF %10 SMD 0603: Ceramic Capacitor, Multilayer, Ceramic, 16V, 10% +Tol, 10% -Tol, X7R, +-15% TC, 1uF, Surface Mount, 0603 inch; Manufacturer: Samsung Electro-Mechanics; Manufacturer Part Number: CL10B105KO8NNNC; Value: 1µF; Supplier: Mouser; Supplier Part Number: 187-CL10B105KO8NNNC; RoHS: Compliant; Category: Ceramic Capacitors; Stock: 621122; Pricing: 1=0,1, 10=0,007, 50=0,007, 100=0,006, 1000=0,006, 10000=0,006 (USD); Case/Package: 0603; Case Code (Imperial): 0603; Case Code (Metric): 1608; China RoHS: Compliant; Depth: 800µm; Dielectric: X7R; Dielectric Material: Ceramic; Height: 800µm; Lead Free: Lead Free; Length: 1.6mm; Lifecycle Status: Production; Material: Ceramic; Max Operating Temperature: 125°C; Min Operating Temperature: -55°C; Mounting Technology: Surface Mount; Number of Terminals: 2; Radiation Hardening: No; REACH SVHC: Yes; Schedule B: 8532240020, 8532240020|8532240020, 8532240020|8532240020|8532240020, 8532240020|8532240020|8532240020|8532240020; Thickness: 889µm; Tolerance: 10%; Voltage: 16V; Voltage Rating: 16V; Voltage Rating (DC): 16V; Width: 800µm; ComponentLink1URL: https://datasheet.octopart.com:443/CL10B105KO8NNNC-Samsung-Electro-Mechanics-datasheet-137745070.pdf?src-supplier=IHS; ComponentLink1Description: https://datasheet.octopart.com:443/CL10B105KO8NNNC-Samsung-Electro-Mechanics-datasheet-137745070.pdf?src-supplier=IHS; ComponentLink2URL: https://datasheet.octopart.com/CL10B105KO8NNNC-Samsung-Electro-Mechanics-datasheet-8324245.pdf; ComponentLink2Description: https://datasheet.octopart.com/CL10B105KO8NNNC-Samsung-Electro-Mechanics-datasheet-8324245.pdf; ComponentLink3URL: https://datasheet.octopart.com/CL10B105KO8NNNC-Samsung-Electro-Mechanics-datasheet-97040617.pdf; ComponentLink3Description: https://datasheet.octopart.com/CL10B105KO8NNNC-Samsung-Electro-Mechanics-datasheet-97040617.pdf; ComponentLink4URL: https://datasheet.octopart.com:443/CL10B105KO8NNNC-Samsung-Electro-Mechanics-datasheet-116890984.pdf?src-supplier=Future+Electronics; ComponentLink4Description: https://datasheet.octopart.com:443/CL10B105KO8NNNC-Samsung-Electro-Mechanics-datasheet-116890984.pdf?src-supplier=Future+Electronics; ComponentLink5URL: https://datasheet.octopart.com:443/CL10B105KO8NNNC-Samsung-Electro-Mechanics-datasheet-81461852.pdf?src-supplier=Future+Electronics; ComponentLink5Description: https://datasheet.octopart.com:443/CL10B105KO8NNNC-Samsung-Electro-Mechanics-datasheet-81461852.pdf?src-supplier=Future+Electronics; ComponentLink6URL: https://datasheet.octopart.com:443/CL10B105KO8NNNC-Samsung-datasheet-42770397.pdf?src-supplier=Future+Electronics; ComponentLink6Description: https://datasheet.octopart.com:443/CL10B105KO8NNNC-Samsung-datasheet-42770397.pdf?src-supplier=Future+Electronics; ComponentLink7URL: https://datasheet.octopart.com:443/CL10B105KO8NNNC-Samsung-datasheet-26669023.pdf?src-supplier=Future+Electronics; ComponentLink7Description: https://datasheet.octopart.com:443/CL10B105KO8NNNC-Samsung-datasheet-26669023.pdf?src-supplier=Future+Electronics; ComponentLink8URL: https://datasheet.octopart.com:443/CL10B105KO8NNNC-Samsung-Electro-Mechanics-datasheet-149136799.pdf?src-supplier=Future+Electronics; ComponentLink8Description: https://datasheet.octopart.com:443/CL10B105KO8NNNC-Samsung-Electro-Mechanics-datasheet-149136799.pdf?src-supplier=Future+Electronics; ComponentLink9URL: https://datasheet.octopart.com:443/CL10B105KO8NNNC-Samsung-datasheet-151956584.pdf?src-supplier=SOS+electronic; ComponentLink9Description: https://datasheet.octopart.com:443/CL10B105KO8NNNC-Samsung-datasheet-151956584.pdf?src-supplier=SOS+electronic; ComponentLink10URL: https://datasheet.octopart.com:443/CL10B105KO8NNNC-Samsung-Electro-Mechanics-datasheet-11774093.pdf?src-supplier=Arrow+Electronics; ComponentLink10Description: https://datasheet.octopart.com:443/CL10B105KO8NNNC-Samsung-Electro-Mechanics-datasheet-11774093.pdf?src-supplier=Arrow+Electronics; ComponentLink11URL: https://datasheet.octopart.com:443/CL10B105KO8NNNC-Samsung-datasheet-59220082.pdf?src-supplier=TME; ComponentLink11Description: https://datasheet.octopart.com:443/CL10B105KO8NNNC-Samsung-datasheet-59220082.pdf?src-supplier=TME; ComponentLink12Description: Tedarikçi; ComponentLink12URL: https://www.ozdisan.com/p/smt-smd-ve-mlcc-kapasitorler-184/samsung-cl10b105ko8nnnc-14234
C21 = Cap Cer 4.7uF %10 SMD 0805: Ceramic Capacitor, Multilayer, Ceramic, 16V, 10% +Tol, 10% -Tol, X7R, +-15% TC, 4.7uF, Surface Mount, 0805 inch; Manufacturer: Samsung Electro-Mechanics; Manufacturer Part Number: CL21B475KOQVPNE; Value: 4.7µF; Supplier: Mouser; Supplier Part Number: 187-CL21B475KOQVPNE; RoHS: Compliant; Category: Ceramic Capacitors; Stock: 39397; Pricing: 1=0,26, 10=0,111, 50=0,111, 100=0,098, 1000=0,07, 10000=0,049 (USD); Case/Package: 0805; Case Code (Imperial): 0805; Case Code (Metric): 2012; China RoHS: Compliant; Dielectric Material: Ceramic; Features: Soft Termination; Height: 1.45mm; Length: 2.0066mm; Lifecycle Status: Production; Material: Ceramic; Max Operating Temperature: 125°C; Min Operating Temperature: -55°C; Mounting Technology: Surface Mount; Number of Terminals: 2; Ratings: AEC-Q200; REACH SVHC: Yes; Thickness: 939.8µm; Tolerance: 10%; Voltage Rating: 16V; Voltage Rating (DC): 16V; Width: 1.2446mm; ComponentLink1URL: https://datasheet.octopart.com:443/CL21B475KOQVPNE-Samsung-Electro-Mechanics-datasheet-176142735.pdf?src-supplier=Farnell; ComponentLink1Description: https://datasheet.octopart.com:443/CL21B475KOQVPNE-Samsung-Electro-Mechanics-datasheet-176142735.pdf?src-supplier=Farnell; ComponentLink2URL: https://datasheet.octopart.com:443/CL21B475KOQVPNE-Samsung-Electro-Mechanics-datasheet-138083831.pdf?src-supplier=Samsung+SCT; ComponentLink2Description: https://datasheet.octopart.com:443/CL21B475KOQVPNE-Samsung-Electro-Mechanics-datasheet-138083831.pdf?src-supplier=Samsung+SCT; ComponentLink3URL: https://datasheet.octopart.com:443/CL21B475KOQVPNE-Samsung-Electro-Mechanics-datasheet-149066738.pdf?src-supplier=Future+Electronics; ComponentLink3Description: https://datasheet.octopart.com:443/CL21B475KOQVPNE-Samsung-Electro-Mechanics-datasheet-149066738.pdf?src-supplier=Future+Electronics; ComponentLink4Description: Tedarikçi; ComponentLink4URL: https://www.ozdisan.com/p/smt-smd-ve-mlcc-kapasitorler-184/samsung-cl21b475koqvpne-522984
D1 = LBAT54CLT1G: BAT54C Series 30 V 200 mA SMT Small Signal Schottky Diode - SOT-23-3; Manufacturer: Vishay; Average Rectified Current: 200mA; Value: 10pF; Element Configuration: Common Cathode; Forward Voltage: 240mV; Max Forward Surge Current (Ifsm): 600mA; Max Junction Temperature (Tj): 125°C; Max Power Dissipation: 230mW; Number of Elements: 2; Peak Reverse Current: 2nA; Recovery Time: 5ns; Reverse Standoff Voltage: 25V; Supplier: Mouser; Supplier Part Number: 78-BAT54C-E3-08; Manufacturer Part Number: LBAT54CLT1G; RoHS: Compliant; Category: Schottky Diodes; Stock: 24375; Pricing: 1=0,18, 10=0,099, 50=0,099, 100=0,085, 1000=0,062, 10000=0,036 (USD); Case/Package: SOT-23; Contact Plating: Tin; Forward Current: 200mA; Height: 1.15mm; Lead Free: Lead Free; Lifecycle Status: Production; Max Operating Temperature: 125°C; Max Output current: 200mA; Max Repetitive Reverse Voltage (Vrrm): 30V; Max Reverse Voltage (DC): 30V; Max Surge Current: 600mA; Min Breakdown Voltage: 30V; Min Operating Temperature: -55°C; Mounting Technology: Surface Mount; Pins: 3; Number of Terminals: 3; Peak Non-Repetitive Surge Current: 600mA; Radiation Hardening: No; REACH SVHC: Yes; Reverse Recovery Time: 5ns; Schedule B: 8541100070, 8541100070|8541100070|8541100070|8541100070|8541100070; Weight: 8.788352mg; ComponentLink1URL: https://datasheet.octopart.com:443/BAT54C-E3-08-Vishay-datasheet-165827645.pdf?src-supplier=Newark; ComponentLink1Description: https://datasheet.octopart.com:443/BAT54C-E3-08-Vishay-datasheet-165827645.pdf?src-supplier=Newark; ComponentLink2URL: https://datasheet.octopart.com:443/BAT54C-E3-08-Vishay-datasheet-68591736.pdf?src-supplier=Newark; ComponentLink2Description: https://datasheet.octopart.com:443/BAT54C-E3-08-Vishay-datasheet-68591736.pdf?src-supplier=Newark; ComponentLink3URL: https://datasheet.octopart.com:443/BAT54C-E3-08-Vishay-datasheet-66534698.pdf?src-supplier=Newark; ComponentLink3Description: https://datasheet.octopart.com:443/BAT54C-E3-08-Vishay-datasheet-66534698.pdf?src-supplier=Newark; ComponentLink4URL: https://datasheet.octopart.com:443/BAT54C-E3-08-Vishay-datasheet-62330688.pdf?src-supplier=Upverter; ComponentLink4Description: https://datasheet.octopart.com:443/BAT54C-E3-08-Vishay-datasheet-62330688.pdf?src-supplier=Upverter; ComponentLink5URL: https://datasheet.octopart.com:443/BAT54C-E3-08-Vishay-datasheet-81713954.pdf?src-supplier=ODG+(Origin+Data+Global); ComponentLink5Description: https://datasheet.octopart.com:443/BAT54C-E3-08-Vishay-datasheet-81713954.pdf?src-supplier=ODG+(Origin+Data+Global); ComponentLink6URL: https://datasheet.octopart.com:443/BAT54C-E3-08-Vishay-datasheet-8399663.pdf?src-supplier=Future+Electronics; ComponentLink6Description: https://datasheet.octopart.com:443/BAT54C-E3-08-Vishay-datasheet-8399663.pdf?src-supplier=Future+Electronics; ComponentLink7URL: https://datasheet.octopart.com:443/BAT54C-E3-08-Vishay-datasheet-5320703.pdf?src-supplier=Future+Electronics; ComponentLink7Description: https://datasheet.octopart.com:443/BAT54C-E3-08-Vishay-datasheet-5320703.pdf?src-supplier=Future+Electronics; ComponentLink8URL: http://sigma.octopart.com:80/rohs_statement/Vishay-company-15.pdf?src-supplier=Compliance+Statements; ComponentLink8Description: http://sigma.octopart.com:80/rohs_statement/Vishay-company-15.pdf?src-supplier=Compliance+Statements; ComponentLink9Description: Tedarikçi; ComponentLink9URL: https://www.ozdisan.com/p/schottky-diyotlar-385/lrc-lbat54clt1g-384549
D2 = SK54BL_R2_00001: DIODE SCHOTTKY 5A 40V DO214AA (SMB) SMT; Diyot Konfigürasyonu: Single; Polarite: Cathode; Çalışma Sıcaklığı: -55 °C ~ +150 °C; Kategori: Schottky Diyotlar; ComponentLink1Description: Tedarikçi; ComponentLink1URL: https://www.ozdisan.com/p/schottky-diyotlar-385/panjit-sk54bl-r2-00001-574556; Seriler: Low VF Schottky Rect.; Kılıf / Kasa: DO214AA (SMB); Ortalama Doğrultulmuş Akım: 5 A; Tepe Tekrarlanan Ters Voltaj (VRRM): 40 V; Montaj Tipi: SMT
D3 D6 = LED GREEN 0805: Single Color LED, Brilliant Yellow Green, Water Clear, 1.4mm; Manufacturer: Everlight; Manufacturer Part Number: 17-21/G6C-FM1N2B/4T; Forward Current: 25mA; Forward Voltage: 2.35V; Luminous Intensity: 18mcd; Number of Circuits: 1; Peak Wavelength: 575nm; Reverse Voltage: 5V; Shape: Rectangular; Supplier: Future Electronics; Supplier Part Number: 2187640; RoHS: Compliant; Category: LEDs; Pricing: 4000=0,0235, 12000=0,023, 20000=0,0227, 80000=0,0221, 120000=0,0216 (USD); Height: 1.1mm; Lifecycle Status: Production; Max Operating Temperature: 85°C; Min Operating Temperature: -40°C; Mounting Technology: Surface Mount; Number of Terminals: 2; REACH SVHC: Yes; Terminal Pitch: 1.6mm; Viewing Angle: 140°; ComponentLink1URL: https://datasheet.octopart.com:443/17-21-G6C-FM1N2B-4T-Everlight-datasheet-182278283.pdf?src-supplier=IHS; ComponentLink1Description: https://datasheet.octopart.com:443/17-21-G6C-FM1N2B-4T-Everlight-datasheet-182278283.pdf?src-supplier=IHS; ComponentLink2Description: Tedarikçi; ComponentLink2URL: https://www.ozdisan.com/p/sinyal-ledler-tek-renkli-361/everlight-17-21-g6c-fm1n2b-4t-745079
D4 D10 D13 = SS1040L_R1_00001: Rectifier Diode, Schottky, 1 Phase, 1 Element, 1A, 40V V(RRM), Silicon; Manufacturer: Panjit; Value: 50pF; Forward Current: 3A; Max Forward Surge Current (Ifsm): 25A; Max Junction Temperature (Tj): 125°C; Max Power Dissipation: 450mW; Number of Elements: 1; Peak Reverse Current: 220µA; Supplier: Mouser; Supplier Part Number: 241-SS1040L_R1_00001; Manufacturer Part Number: SS1040L_R1_00001; RoHS: Compliant; Category: Rectifier Diodes; Stock: 4923; Pricing: 1=0,19, 10=0,125, 50=0,125, 100=0,083, 1000=0,06, 10000=0,033 (USD); Export Control Classification Number (ECCN) Code: EAR99; Height: 1.35mm; Harmonized Tariff Schedule (HTS) Code: 8541.10.00.80; Introduction Date: 2012-02-22; Lifecycle Status: Production; Max Operating Temperature: 125°C; Max Output current: 1A; Max Repetitive Reverse Voltage (Vrrm): 40V; Min Operating Temperature: -65°C; Number of Terminals: 2; REACH SVHC: Yes; Reverse Standoff Voltage: 40V; Reverse Voltage: 40V; ComponentLink1URL: https://datasheet.octopart.com:443/SS1040L_R1_00001-Panjit-datasheet-180983456.pdf?src-supplier=IHS; ComponentLink1Description: https://datasheet.octopart.com:443/SS1040L_R1_00001-Panjit-datasheet-180983456.pdf?src-supplier=IHS; ComponentLink2URL: https://datasheet.octopart.com:443/SS1040L_R1_00001-Panjit-datasheet-151294496.pdf?src-supplier=TECHDesign; ComponentLink2Description: https://datasheet.octopart.com:443/SS1040L_R1_00001-Panjit-datasheet-151294496.pdf?src-supplier=TECHDesign; ComponentLink3Description: Tedarikçi; ComponentLink3URL: https://www.ozdisan.com/p/schottky-diyotlar-385/panjit-ss1040l-r1-00001-574659